# Altium schematic sheet [5] ButtonsAndLEDs.SchDoc: =DocumentName
size A3; ENG_APP_DATE: --/--/--; DSN_APP_DATE: --/--/--; CHK_APP_DATE: --/--/--; Organization: ORGANIZATION; Address1: R. Aprígio Veloso, 882, Universitário; Address2: Campina Grande - PB; Address3: 58429-900; DocumentNumber: 5; Revision: -; SheetNumber: 5; SheetTotal: 9; ENG_DATE: --/--/--; DSN_DATE: --/--/--; CHK_DATE: --/--/--; SCH_SCALE: 1:1
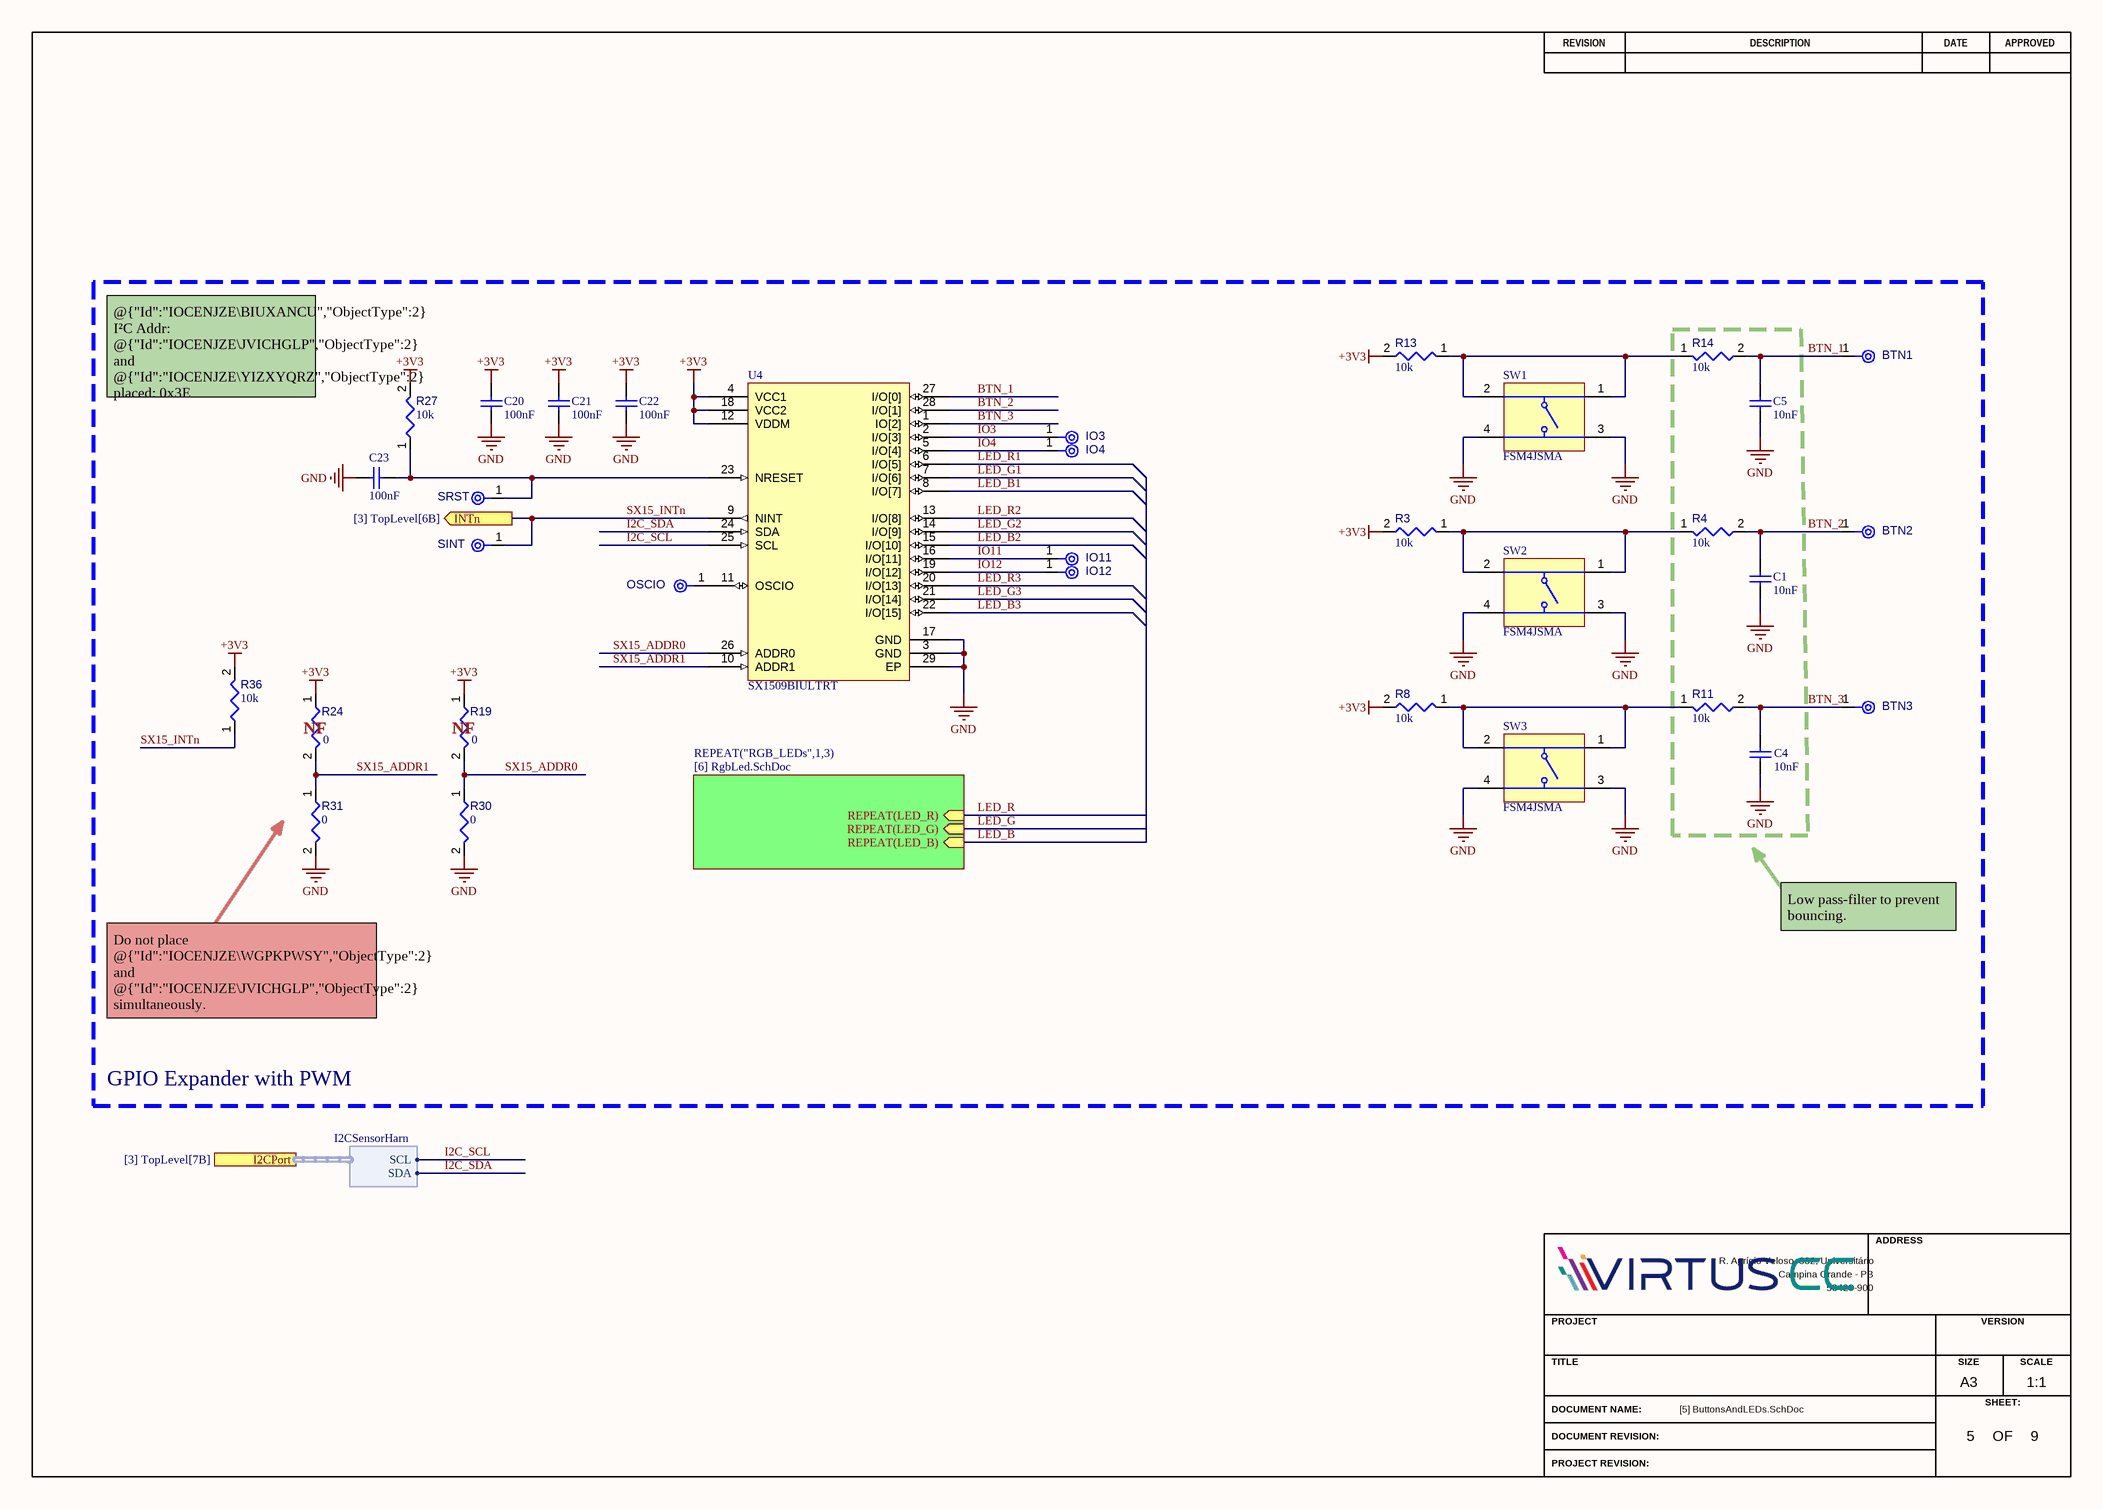
[diagram p0: [5] ButtonsAndLEDs.SchDoc]

## Parts
BTN1  TPAD6R  [TP06R]  (value not drawn)  (no BOM)
BTN2  TPAD6R  [TP06R]  (value not drawn)  (no BOM)
BTN3  TPAD6R  [TP06R]  (value not drawn)  (no BOM)
C1  value 10nF  [CAPC0603(1608)100_L]  (hidden comment: VJ0603Y103KXAAC)
C4  value 10nF  [CAPC0603(1608)100_L]  (hidden comment: VJ0603Y103KXAAC)
C5  value 10nF  [CAPC0603(1608)100_L]  (hidden comment: VJ0603Y103KXAAC)
C20  value 100nF  [CAPC0603(1608)100_L]  (hidden comment: VJ0603Y104MXJCW1BC)
C21  value 100nF  [CAPC0603(1608)100_L]  (hidden comment: VJ0603Y104MXJCW1BC)
C22  value 100nF  [CAPC0603(1608)100_L]  (hidden comment: VJ0603Y104MXJCW1BC)
C23  value 100nF  [CAPC0603(1608)100_L]  (hidden comment: VJ0603Y104MXJCW1BC)
IO3  TPAD6R  [TP06R]  (value not drawn)  (no BOM)
IO4  TPAD6R  [TP06R]  (value not drawn)  (no BOM)
IO11  TPAD6R  [TP06R]  (value not drawn)  (no BOM)
IO12  TPAD6R  [TP06R]  (value not drawn)  (no BOM)
OSCIO  TPAD6R  [TP06R]  (value not drawn)  (no BOM)
R3  value 10k  [RESC0603(1608)_L]  (hidden comment: Resistor 10k +/-1% 0603 100 mW)
R4  value 10k  [RESC0603(1608)_L]  (hidden comment: Resistor 10k +/-1% 0603 100 mW)
R8  value 10k  [RESC0603(1608)_L]  (hidden comment: Resistor 10k +/-1% 0603 100 mW)
R11  value 10k  [RESC0603(1608)_L]  (hidden comment: Resistor 10k +/-1% 0603 100 mW)
R13  value 10k  [RESC0603(1608)_L]  (hidden comment: Resistor 10k +/-1% 0603 100 mW)
R14  value 10k  [RESC0603(1608)_L]  (hidden comment: Resistor 10k +/-1% 0603 100 mW)
R19  value 0  [RESC0603(1608)_L]  (hidden comment: Resistor 0R +/- 5% 0603 100 mW)
R24  value 0  [RESC0603(1608)_L]  (hidden comment: Resistor 0R +/- 5% 0603 100 mW)
R27  value 10k  [RESC0603(1608)_L]  (hidden comment: Resistor 10k +/-1% 0603 100 mW)
R30  value 0  [RESC0603(1608)_L]  (hidden comment: Resistor 0R +/- 5% 0603 100 mW)
R31  value 0  [RESC0603(1608)_L]  (hidden comment: Resistor 0R +/- 5% 0603 100 mW)
R36  value 10k  [RESC0603(1608)_L]  (hidden comment: Resistor 10k +/-1% 0603 100 mW)
SINT  TPAD6R  [TP06R]  (value not drawn)  (no BOM)
SRST  TPAD6R  [TP06R]  (value not drawn)  (no BOM)
SW1  FSM4JSMA  [TECO-FSM4JSMA_V]
SW2  FSM4JSMA  [TECO-FSM4JSMA_V]
SW3  FSM4JSMA  [TECO-FSM4JSMA_V]
U4  SX1509BIULTRT  [QFN40P410X410X60_HS-29N]

## Sub-sheets
REPEAT("RGB_LEDs",1,3) = [6] RgbLed.SchDoc: REPEAT(LED_R) (in), REPEAT(LED_G) (in), REPEAT(LED_B) (in)

## Ports
I2CPort (harness I2CSensorHarn, see [3] TopLevel[7B]), INTn (out, see [3] TopLevel[6B])

## Harnesses
I2CSensorHarn: SCL, SDA

## Nets
+3V3: C20.1 C21.1 C22.1 R3.2 R8.2 R13.2 R19.1 R24.1 R27.2 R36.2 U4.4(VCC1) U4.12(VDDM) U4.18(VCC2)
GND: C1.1 C4.1 C5.1 C20.2 C21.2 C22.2 C23.2 R30.2 R31.2 SW1.3 SW1.4 SW2.3 SW2.4 SW3.3 SW3.4 U4.3(GND) U4.17(GND) U4.29(EP)
BTN_1: BTN1.1(TP) C5.2 R14.2 U4.27(I/O[0])
BTN_2: BTN2.1(TP) C1.2 R4.2 U4.28(I/O[1])
BTN_3: BTN3.1(TP) C4.2 R11.2 U4.1(IO[2])
I2C_SCL: U4.25(SCL) ; port I2CPort.SCL
I2C_SDA: U4.24(SDA) ; port I2CPort.SDA
IO3: IO3.1(TP) U4.2(I/O[3])
IO4: IO4.1(TP) U4.5(I/O[4])
IO11: IO11.1(TP) U4.16(I/O[11])
IO12: IO12.1(TP) U4.19(I/O[12])
LED_B: sheet REPEAT("RGB_LEDs",1,3)/REPEAT(LED_B)
LED_B1: U4.8(I/O[7])
LED_B2: U4.15(I/O[10])
LED_B3: U4.22(I/O[15])
LED_G: sheet REPEAT("RGB_LEDs",1,3)/REPEAT(LED_G)
LED_G1: U4.7(I/O[6])
LED_G2: U4.14(I/O[9])
LED_G3: U4.21(I/O[14])
LED_R: sheet REPEAT("RGB_LEDs",1,3)/REPEAT(LED_R)
LED_R1: U4.6(I/O[5])
LED_R2: U4.13(I/O[8])
LED_R3: U4.20(I/O[13])
SX15_ADDR0: R19.2 R30.1 U4.26(ADDR0)
SX15_ADDR1: R24.2 R31.1 U4.10(ADDR1)
SX15_INTn: R36.1 SINT.1(TP) U4.9(NINT) ; port INTn
NetC23_1: C23.1 R27.1 SRST.1(TP) U4.23(NRESET)
NetOSCIO_1: OSCIO.1(TP) U4.11(OSCIO)
NetR3_1: R3.1 R4.1 SW2.1 SW2.2
NetR8_1: R8.1 R11.1 SW3.1 SW3.2
NetR13_1: R13.1 R14.1 SW1.1 SW1.2

## Notes on the sheet
- @{"Id":"IOCENJZE\BIUXANCU","ObjectType":2}  I²C Addr:
  @{"Id":"IOCENJZE\JVICHGLP","ObjectType":2} and @{"Id":"IOCENJZE\YIZXYQRZ","ObjectType":2} placed: 0x3E
  @{"Id":"IOCENJZE\JVICHGLP","ObjectType":2} and @{"Id":"IOCENJZE\LAJIQSGS","ObjectType":2} placed: 0x3F
  @{"Id":"IOCENJZE\WGPKPWSY","ObjectType":2} and @{"Id":"IOCENJZE\YIZXYQRZ","ObjectType":2} placed: 0x70
  @{"Id":"IOCENJZE\WGPKPWSY","ObjectType":2} and @{"Id":"IOCENJZE\LAJIQSGS","ObjectType":2} placed: 0x71
- (near R24) NF
- (near R19) NF
- Low pass-filter to prevent bouncing.
- Do not place @{"Id":"IOCENJZE\WGPKPWSY","ObjectType":2} and @{"Id":"IOCENJZE\JVICHGLP","ObjectType":2} simultaneously.
  Do not place @{"Id":"IOCENJZE\LAJIQSGS","ObjectType":2} and @{"Id":"IOCENJZE\YIZXYQRZ","ObjectType":2} simultaneously.
- GPIO Expander with PWM
- REVISION
- DESCRIPTION
- DATE
- APPROVED
- ADDRESS
- PROJECT
- VERSION
- TITLE
- A3
- SIZE
- SCALE
- DOCUMENT NAME:
- DOCUMENT REVISION:
- OF
- SHEET:
- PROJECT REVISION:

## Library data of the parts
BTN1-BTN3 IO3 IO4 IO11 IO12 OSCIO SINT SRST = CMP-00028-00002-2: 0.6mm round; Pins: 1
C1 C4 C5 = CMP-001-00084-1: Multilayer Ceramic Capacitor, 0.01 uF, 50 V, ± 10%, X7R, 0603 [1608 Metric]; Voltage Rating: 50V; Height: 0.92mm; Voltage Rating (DC): 50V; Depth: 0.8mm; Case Code (Imperial): 0603; Packaging: Tape and Reel; Length: 1.6mm; Max Operating Temperature: 125°C; Min Operating Temperature: -55°C; Case/Package: 0603; Pins: 2; Series: VJ; Thickness: 0.036inch; Weight: 7.1E-05oz; Reach SVHC Compliant: Unknown; Termination: SMD/SMT; Package Quantity: 1; RoHS Compliant: Yes; Mounting Technology: Surface Mount; Construction: Flat; Voltage: 50V; Lead Free: Lead Free; Width: 0.031inch; Case Code (Metric): 1608; Tolerance: 10%; Dielectric: X7R
C20-C23 = CMP-001-00085-1: Multilayer Ceramic Capacitor, 0.1 uF, 16 V, ± 20%, X7R, 0603 [1608 Metric]; Dielectric Material: Tantalum; Voltage Rating: 16V; Packaging: Tape and Reel; Min Operating Temperature: -55°C; Case/Package: 0603; Length: 1.6mm; Termination: SMD/SMT; Height: 0.95mm; Mounting Technology: Surface Mount; Width: 0.8mm; Case Code (Imperial): 0603; Construction: Flat; Lead Free: Lead Free; Package Quantity: 4000; Max Operating Temperature: 125°C; Dielectric: X7R; RoHS Compliant: Yes; Depth: 0.8mm; Tolerance: 20%; Series: VJ; Case Code (Metric): 1608; Voltage Rating (DC): 16V
R3 R4 R8 R11 R13 R14 R27 R36 = CMP-009-00017-7: Chip Resistor, 10 KOhm, +/- 1%, 01 W, -55 to 155 degC, 0603 (1608 Metric); Voltage Rating: 50V; Power: 100mW; RoHS Compliant: True; Min Operating Temperature: -55°C; Pins: 2; Case/Package: 0603; Mounting Technology: SM; Max Operating Temperature: 155°C; Tolerance: 1%
R19 R24 R30 R31 = CMP-009-00006-6: Chip Resistor, 0 Ohm, 0.1 W, -55 to 155 degC, 0603 (1608 Metric); Power: 100mW; Voltage Rating: 50V; Tolerance: 5%; Mounting Technology: SM; RoHS Compliant: True; Max Operating Temperature: 155°C; Min Operating Temperature: -55°C; Case/Package: 0603; Pins: 2
SW1-SW3 = CMP-011-00013-1: Switch Tactile OFF (ON) SPST Round Button Gull Wing 0.05A 12VDC 1.57N SMD Loose Piece; Switch Travel: 0.25mm; Mechanical Life: 100000Cycles; Contact Current Rating: 50mA; Actuator Material: Polyphenylene; Voltage Rating: 24V; Illumination Type: Non-Illuminated,Illuminated; Actuator Length: 1.4mm; Actuator Type: Standard; Switch Function: Off-Mom; Insulation Resistance: 100MR; Orientation: Straight; Min Operating Temperature: -35°C; Packaging: Bulk; Termination: Gull Wing; Throw Configuration: SPST; Mounting Technology: Surface Mount; Operating Force: 1.57N; Contact Plating: Silver; Max Operating Temperature: 85°C; Length: 6mm; Voltage Rating (DC): 24V; Current Rating: 50mA; Package Quantity: 750; Width: 6mm; Contact Material: Copper Alloy,Silver; Max Current Rating: 50mA; Depth: 10mm; Series: FSMJSMA; ELV: Compliant; Case/Package: SMD/SMT; Color: Black; Reach SVHC Compliant: Unknown; RoHS Compliant: Yes; Lead Free: Lead Free
U4 = CMP-016-00011-5: IC Gpio Expander I2C 16CH 28QFN / I2C Interface 5.5V 28-PIN Qfn-ut Ep T/r; Frequency: 400kHz; Number of I/Os: 16; Lead Free: Lead Free; Series: -; RoHS Compliant: Yes; Interface: I2C; Min Operating Temperature: -40°C; Pins: 28; Mounting Technology: Surface Mount; Case/Package: QFN; Max Operating Temperature: 85°C; Packaging: Cut Tape